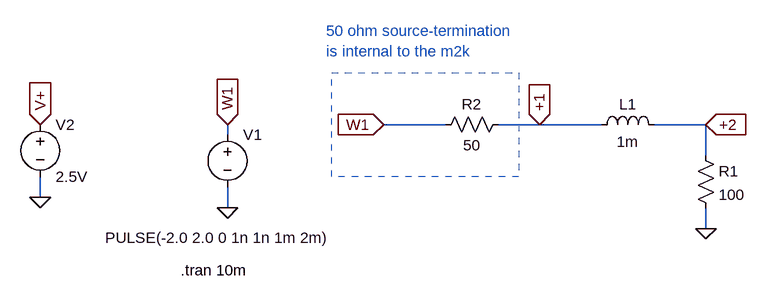
[diagram p0: schematic transient_response_RL_series.asc]
transient_response_RL_series.asc, the LTspice schematic file:
Version 4
SHEET 1 880 680
WIRE 192 144 96 144
WIRE 336 144 272 144
WIRE 432 144 336 144
WIRE 592 144 512 144
WIRE -144 160 -144 144
WIRE 592 192 592 144
WIRE -432 256 -432 224
WIRE -144 272 -144 240
WIRE 592 304 592 272
FLAG -144 272 0
FLAG -144 144 W1
IOPIN -144 144 In
FLAG 96 144 W1
IOPIN 96 144 In
FLAG 336 144 +1
IOPIN 336 144 In
FLAG 592 144 +2
IOPIN 592 144 In
FLAG -432 256 0
FLAG -432 144 V+
IOPIN -432 144 In
FLAG 592 304 0
SYMBOL voltage -144 144 R0
WINDOW 123 0 0 Left 0
WINDOW 39 0 0 Left 0
WINDOW 3 -188 174 Left 2
SYMATTR Value PULSE(-2.0 2.0 0 1n 1n 1m 2m)
SYMATTR InstName V1
SYMBOL voltage -432 128 R0
WINDOW 123 0 0 Left 0
WINDOW 39 0 0 Left 0
SYMATTR InstName V2
SYMATTR Value 2.5V
SYMBOL res 576 176 R0
SYMATTR InstName R1
SYMATTR Value 100
SYMBOL ind 416 160 R270
WINDOW 0 32 56 VTop 2
WINDOW 3 5 56 VBottom 2
SYMATTR InstName L1
SYMATTR Value 1m
SYMBOL res 288 128 R90
WINDOW 0 0 56 VBottom 2
WINDOW 3 32 56 VTop 2
SYMATTR InstName R2
SYMATTR Value 50
TEXT -216 368 Left 2 !.tran 10m
TEXT 8 0 Left 2 ;50 ohm source-termination\nis internal to the m2k
RECTANGLE Normal 304 224 16 64 2

The netlist it stands for:
* transient_response_RL_series.asc
V1 W1 0 PULSE(-2.0 2.0 0 1n 1n 1m 2m)
V2 V+ 0 2.5V
R1 +2 0 100
L1 +1 +2 1m
R2 +1 W1 50
.tran 10m
* 50 ohm source-termination
* is internal to the m2k
.backanno
.end